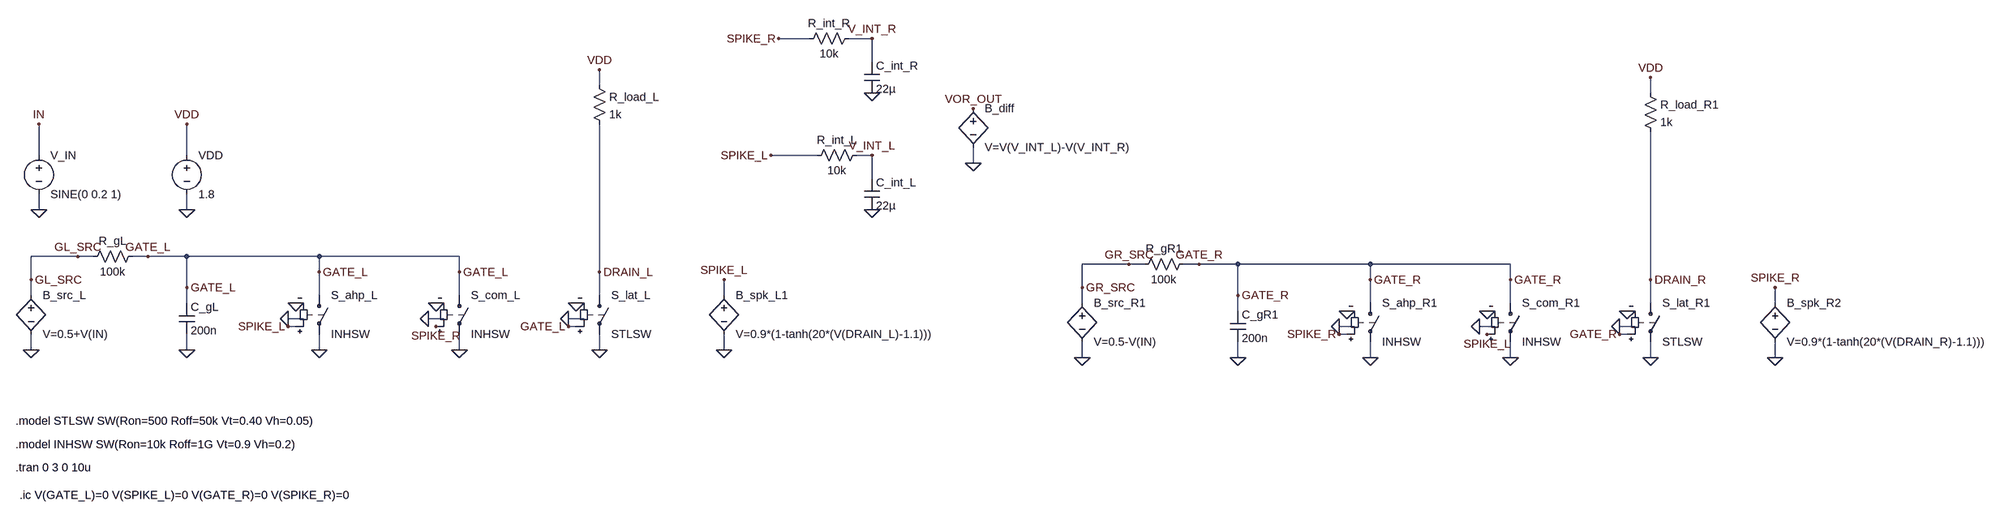
[diagram p0: schematic circuit_ver1_0814.asc]
circuit_ver1_0814.asc, the LTspice schematic file:
Version 4.1
SHEET 1 4196 1800
WIRE 1728 464 1664 464
WIRE 1856 464 1808 464
WIRE 1856 512 1856 464
WIRE 1296 560 1296 528
WIRE 3456 576 3456 544
WIRE 144 704 144 640
WIRE 448 704 448 640
WIRE 1744 704 1648 704
WIRE 1856 704 1824 704
WIRE 2064 720 2064 688
WIRE 1856 752 1856 704
WIRE 144 816 144 784
WIRE 448 816 448 784
WIRE 224 912 128 912
WIRE 256 912 224 912
WIRE 368 912 336 912
WIRE 448 912 368 912
WIRE 720 912 448 912
WIRE 1008 912 720 912
WIRE 2384 928 2288 928
WIRE 2416 928 2384 928
WIRE 2528 928 2496 928
WIRE 2608 928 2528 928
WIRE 2880 928 2608 928
WIRE 3168 928 2880 928
WIRE 720 944 720 912
WIRE 1008 944 1008 912
WIRE 1296 944 1296 640
WIRE 128 960 128 912
WIRE 2880 960 2880 928
WIRE 3168 960 3168 928
WIRE 3456 960 3456 656
WIRE 448 976 448 912
WIRE 2288 976 2288 928
WIRE 128 992 128 960
WIRE 720 992 720 944
WIRE 1008 992 1008 944
WIRE 1296 992 1296 944
WIRE 1552 992 1552 960
WIRE 2608 992 2608 928
WIRE 448 1008 448 976
WIRE 688 1008 672 1008
WIRE 976 1008 960 1008
WIRE 1264 1008 1248 1008
WIRE 2288 1008 2288 976
WIRE 2880 1008 2880 960
WIRE 3168 1008 3168 960
WIRE 3456 1008 3456 960
WIRE 3712 1008 3712 976
WIRE 2608 1024 2608 992
WIRE 2848 1024 2832 1024
WIRE 3136 1024 3120 1024
WIRE 3424 1024 3408 1024
WIRE 688 1040 656 1040
WIRE 976 1040 944 1040
WIRE 1264 1040 1232 1040
WIRE 672 1056 656 1056
WIRE 1248 1056 1232 1056
WIRE 2848 1056 2816 1056
WIRE 3136 1056 3104 1056
WIRE 3424 1056 3392 1056
WIRE 2832 1072 2816 1072
WIRE 3408 1072 3392 1072
WIRE 128 1104 128 1072
WIRE 448 1104 448 1072
WIRE 720 1104 720 1072
WIRE 1008 1104 1008 1072
WIRE 1296 1104 1296 1072
WIRE 1552 1104 1552 1072
WIRE 2288 1120 2288 1088
WIRE 2608 1120 2608 1088
WIRE 2880 1120 2880 1088
WIRE 3168 1120 3168 1088
WIRE 3456 1120 3456 1088
WIRE 3712 1120 3712 1088
FLAG 128 960 GL_SRC
FLAG 128 1104 0
FLAG 224 912 GL_SRC
FLAG 368 912 GATE_L
FLAG 448 976 GATE_L
FLAG 448 1104 0
FLAG 1296 528 VDD
FLAG 1296 944 DRAIN_L
FLAG 1296 1104 0
FLAG 1232 1056 GATE_L
FLAG 1232 1040 0
FLAG 720 944 GATE_L
FLAG 720 1104 0
FLAG 656 1056 SPIKE_L
FLAG 656 1040 0
FLAG 1008 944 GATE_L
FLAG 1008 1104 0
FLAG 944 1040 0
FLAG 1552 960 SPIKE_L
FLAG 1552 1104 0
FLAG 144 816 0
FLAG 448 816 0
FLAG 144 640 IN
FLAG 448 640 VDD
FLAG 672 1008 0
FLAG 1248 1008 0
FLAG 2288 976 GR_SRC
FLAG 2288 1120 0
FLAG 2384 928 GR_SRC
FLAG 2528 928 GATE_R
FLAG 2608 992 GATE_R
FLAG 2608 1120 0
FLAG 3456 544 VDD
FLAG 3456 960 DRAIN_R
FLAG 3456 1120 0
FLAG 3392 1072 GATE_R
FLAG 3392 1056 0
FLAG 2880 960 GATE_R
FLAG 2880 1120 0
FLAG 2816 1072 SPIKE_R
FLAG 2816 1056 0
FLAG 3168 960 GATE_R
FLAG 3168 1120 0
FLAG 3120 1072 SPIKE_L
FLAG 3104 1056 0
FLAG 3712 976 SPIKE_R
FLAG 3712 1120 0
FLAG 2832 1024 0
FLAG 3120 1024 0
FLAG 3408 1024 0
FLAG 960 1008 0
FLAG 960 1056 SPIKE_R
FLAG 1648 704 SPIKE_L
FLAG 1664 464 SPIKE_R
FLAG 1856 704 V_INT_L
FLAG 1856 464 V_INT_R
FLAG 2064 720 0
FLAG 2064 608 VOR_OUT
FLAG 1856 576 0
FLAG 1856 816 0
SYMBOL bv 128 976 R0
SYMATTR InstName B_src_L
SYMATTR Value V=0.5+V(IN)
SYMBOL res 240 928 R270
WINDOW 0 32 56 VTop 2
WINDOW 3 0 56 VBottom 2
SYMATTR InstName R_gL
SYMATTR Value 100k
SYMBOL cap 432 1008 R0
SYMATTR InstName C_gL
SYMATTR Value 200n
SYMBOL res 1280 544 R0
SYMATTR InstName R_load_L
SYMATTR Value 1k
SYMBOL sw 1296 976 R0
SYMATTR InstName S_lat_L
SYMATTR Value STLSW
SYMBOL sw 720 976 R0
SYMATTR InstName S_ahp_L
SYMATTR Value INHSW
SYMBOL sw 1008 976 R0
SYMATTR InstName S_com_L
SYMATTR Value INHSW
SYMBOL bv 1552 976 R0
SYMATTR InstName B_spk_L1
SYMATTR Value V=0.9*(1-tanh(20*(V(DRAIN_L)-1.1)))
SYMBOL voltage 144 688 R0
WINDOW 123 0 0 Left 0
WINDOW 39 0 0 Left 0
SYMATTR InstName V_IN
SYMATTR Value SINE(0 0.2 1)
SYMBOL voltage 448 688 R0
WINDOW 123 0 0 Left 0
WINDOW 39 0 0 Left 0
SYMATTR InstName VDD
SYMATTR Value 1.8
SYMBOL bv 2288 992 R0
SYMATTR InstName B_src_R1
SYMATTR Value V=0.5-V(IN)
SYMBOL res 2400 944 R270
WINDOW 0 32 56 VTop 2
WINDOW 3 0 56 VBottom 2
SYMATTR InstName R_gR1
SYMATTR Value 100k
SYMBOL cap 2592 1024 R0
SYMATTR InstName C_gR1
SYMATTR Value 200n
SYMBOL res 3440 560 R0
SYMATTR InstName R_load_R1
SYMATTR Value 1k
SYMBOL sw 3456 992 R0
SYMATTR InstName S_lat_R1
SYMATTR Value STLSW
SYMBOL sw 2880 992 R0
SYMATTR InstName S_ahp_R1
SYMATTR Value INHSW
SYMBOL sw 3168 992 R0
SYMATTR InstName S_com_R1
SYMATTR Value INHSW
SYMBOL bv 3712 992 R0
SYMATTR InstName B_spk_R2
SYMATTR Value V=0.9*(1-tanh(20*(V(DRAIN_R)-1.1)))
SYMBOL res 1840 688 R90
WINDOW 0 0 56 VBottom 2
WINDOW 3 32 56 VTop 2
SYMATTR InstName R_int_L
SYMATTR Value 10k
SYMBOL res 1824 448 R90
WINDOW 0 0 56 VBottom 2
WINDOW 3 32 56 VTop 2
SYMATTR InstName R_int_R
SYMATTR Value 10k
SYMBOL cap 1840 752 R0
SYMATTR InstName C_int_L
SYMATTR Value 22µ
SYMBOL cap 1840 512 R0
SYMATTR InstName C_int_R
SYMATTR Value 22µ
SYMBOL bv 2064 592 R0
SYMATTR InstName B_diff
SYMATTR Value V=V(V_INT_L)-V(V_INT_R)
TEXT 96 1312 Left 2 !.model STLSW SW(Ron=500 Roff=50k Vt=0.40 Vh=0.05)
TEXT 96 1360 Left 2 !.model INHSW SW(Ron=10k Roff=1G Vt=0.9 Vh=0.2)
TEXT 96 1408 Left 2 !.tran 0 3 0 10u
TEXT 104 1464 Left 2 !.ic V(GATE_L)=0 V(SPIKE_L)=0 V(GATE_R)=0 V(SPIKE_R)=0

The netlist it stands for:
* circuit_ver1_0814.asc
B_src_L GL_SRC 0 V=0.5+V(IN)
R_gL GL_SRC GATE_L 100k
C_gL GATE_L 0 200n
R_load_L VDD DRAIN_L 1k
S_lat_L DRAIN_L 0 GATE_L 0 STLSW
S_ahp_L GATE_L 0 SPIKE_L 0 INHSW
S_com_L GATE_L 0 SPIKE_R 0 INHSW
B_spk_L1 SPIKE_L 0 V=0.9*(1-tanh(20*(V(DRAIN_L)-1.1)))
V_IN IN 0 SINE(0 0.2 1)
VDD VDD 0 1.8
B_src_R1 GR_SRC 0 V=0.5-V(IN)
R_gR1 GR_SRC GATE_R 100k
C_gR1 GATE_R 0 200n
R_load_R1 VDD DRAIN_R 1k
S_lat_R1 DRAIN_R 0 GATE_R 0 STLSW
S_ahp_R1 GATE_R 0 SPIKE_R 0 INHSW
S_com_R1 GATE_R 0 SPIKE_L 0 INHSW
B_spk_R2 SPIKE_R 0 V=0.9*(1-tanh(20*(V(DRAIN_R)-1.1)))
R_int_L V_INT_L SPIKE_L 10k
R_int_R V_INT_R SPIKE_R 10k
C_int_L V_INT_L 0 22µ
C_int_R V_INT_R 0 22µ
B_diff VOR_OUT 0 V=V(V_INT_L)-V(V_INT_R)
.model STLSW SW(Ron=500 Roff=50k Vt=0.40 Vh=0.05)
.model INHSW SW(Ron=10k Roff=1G Vt=0.9 Vh=0.2)
.tran 0 3 0 10u
.ic V(GATE_L)=0 V(SPIKE_L)=0 V(GATE_R)=0 V(SPIKE_R)=0
.backanno
.end